# EAGLE design control_board-hall_test (EAGLE 8.3.1)
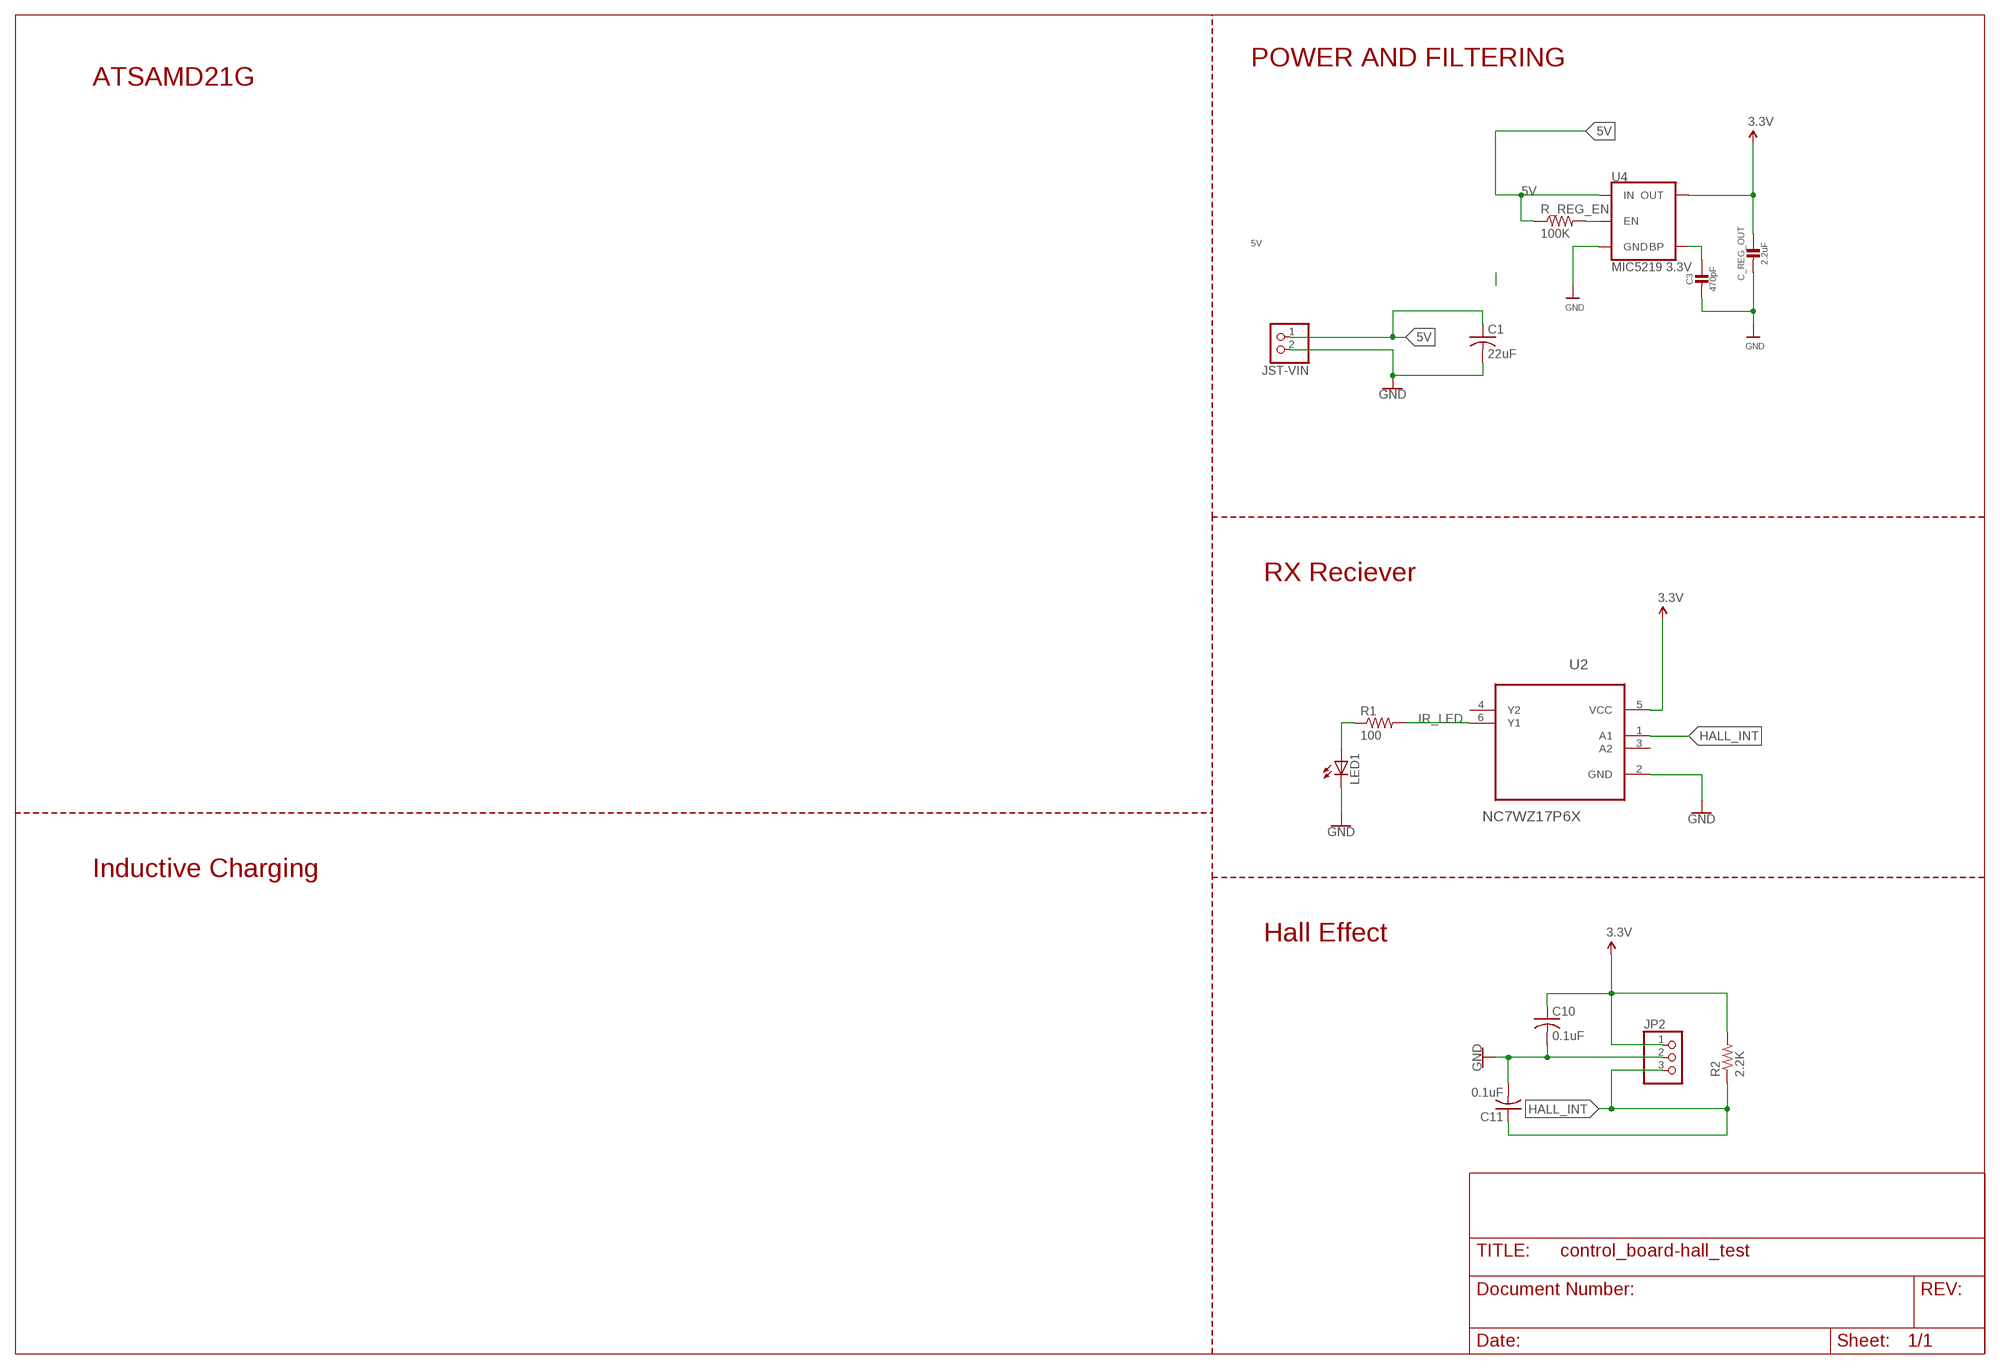
[diagram p0: schematic, sheet 1]

## Parts
C1  22uF  C-USC1206  [C1206]
C3  470pF  CAP_CERAMIC0603_NO  [0603-NO]
C10  0.1uF  C-USC0603  [C0603]
C11  0.1uF  C-USC0603  [C0603]
C_REG_OUT  2.2uF  CAP_CERAMIC0805-NOOUTLINE  [0805-NO]
JP2  PINHD-1X3  [1X03]
JST-VIN  JST_2PIN-THM-RA  [JST-PH-2-THM-RA]
LED1  LED3MM  [LED3MM]
R1  100  R-US_0207/9  [0207/9]
R2  2.2K  R-US_0207/9  [0207/9]
R_REG_EN  100K  R-US_R0603  [R0603]
U2  NC7WZ17P6X  [SOT65P210X110-6N]
U4  MIC5219 3.3V  V_REG_MIC52193.3V  [SOT23-5]

## Nets
3.3V: C10.1 C_REG_OUT.1 JP2.1 R2.2 U2.5(VCC) U4.5(OUT)
5V: C1.1 JST-VIN.1 R_REG_EN.1 U4.1(IN)
GND: C1.2 C3.2 C10.2 C11.2 C_REG_OUT.2 JP2.2 JST-VIN.2 LED1.K(C) U2.2(GND) U4.2(GND)
HALL_INT: C11.1 JP2.3 R2.1 U2.1(A1)
IR_LED: R1.2 U2.6(Y1)
N$1: LED1.A R1.1
N$5: R_REG_EN.2 U4.3(EN)
N$6: C3.1 U4.4(BP)
Unconnected: U2.3(A2) U2.4(Y2)

## Notes on the sheet
- ATSAMD21G | POWER AND FILTERING
- RX Reciever
- Inductive Charging
- Hall Effect

## Library data of the parts
C1 C10 C11 = adafruit:C-US: CAPACITOR, American symbol
C3 C_REG_OUT = microbuilder:CAP_CERAMIC: Ceramic Capacitors For new designs, use the packages preceded by an '_' character since they are more reliable: The following footprints should be used on most boards: _0402 - Standard footprint for regular board layouts _0603 - Standard footprint for regular board layouts _0805 - Standard footprint for regular board layouts _1206 - Standard footprint for regular board layouts For extremely tight-pitch boards where space is at a premium, the following 'micro-pitch' footprints can be used (smaller pads, no silkscreen outline, etc.): _0402MP - Micro-pitch footprint for very dense/compact boards _0603MP - Micro-pitch footprint for very dense/compact boards _0805MP - Micro-pitch footprint for very dense/compact boards _1206MP - Micro-pitch footprint for very dense/compact boards
JP2 = pinhead:PINHD-1X3: PIN HEADER
JST-VIN = adafruit:JST_2PIN: JST 2-Pin Connectors of various flavors SMT-RA (S2B-PH-SM4) 4UConnector #17311 SMT (B2B-PH-SM4) THM-RA (S2B-PH) THM (B2B-PH)
LED1 = adafruit:LED: LED OSRAM: - CHIPLED LG R971, LG N971, LY N971, LG Q971, LY Q971, LO R971, LY R971 LH N974, LH R974 LS Q976, LO Q976, LY Q976 LO Q996 - Hyper CHIPLED LW Q18S LB Q993, LB Q99A, LB R99A - SideLED LS A670, LO A670, LY A670, LG A670, LP A670 LB A673, LV A673, LT A673, LW A673 LH A674 LY A675 LS A676, LA A676, LO A676, LY A676, LW A676 LS A679, LY A679, LG A679 - Hyper Micro SIDELED® LS Y876, LA Y876, LO Y876, LY Y876 LT Y87S - SmartLED LW L88C, LW L88S LB L89C, LB L89S, LG L890 LS L89K, LO L89K, LY L89K LS L896, LA L896, LO L896, LY L896 - TOPLED LS T670, LO T670, LY T670, LG T670, LP T670 LSG T670, LSP T670, LSY T670, LOP T670, LYG T670 LG T671, LOG T671, LSG T671 LB T673, LV T673, LT T673, LW T673 LH T674 LS T676, LA T676, LO T676, LY T676, LB T676, LH T676, LSB T676, LW T676 LB T67C, LV T67C, LT T67C, LS T67K, LO T67K, LY T67K, LW E67C LS E67B, LA E67B, LO E67B, LY E67B, LB E67C, LV E67C, LT E67C LW T67C LS T679, LY T679, LG T679 LS T770, LO T770, LY T770, LG T770, LP T770 LB T773, LV T773, LT T773, LW T773 LH T774 LS E675, LA E675, LY E675, LS T675 LS T776, LA T776, LO T776, LY T776, LB T776 LHGB T686 LT T68C, LB T68C - Hyper Mini TOPLED® LB M676 - Mini TOPLED Santana® LG M470 LS M47K, LO M47K, LY M47K Source: http://www.osram.convergy.de/
R1 R2 R_REG_EN = adafruit:R-US_: RESISTOR, American symbol
U2 = NC7WZ17P6X:NC7WZ17P6X: Dual Buffer; AVAILABILITY: Good; DESCRIPTION: NC7WZ17 Series 5.5 V TinyLogic UHS Dual Buffer w/ Schmitt Trigger Inputs-SC-70-6; MF: Fairchild Semiconductor; MP: NC7WZ17P6X; PACKAGE: SC-70-6 Fairchild Semiconductor; PRICE: 0.10 USD
U4 = SparkFun-IC-Power:V_REG_MIC5219: V_REG MIC5219 Standard 3.3V and 5V 500mA LDO voltage regulator in SOT-23 layout. Micrel part MIC5219. BP (by-pass) pin is used to lower output noise with 470pF cap, may be left open.; PROD_ID: VREG-09872

## Board
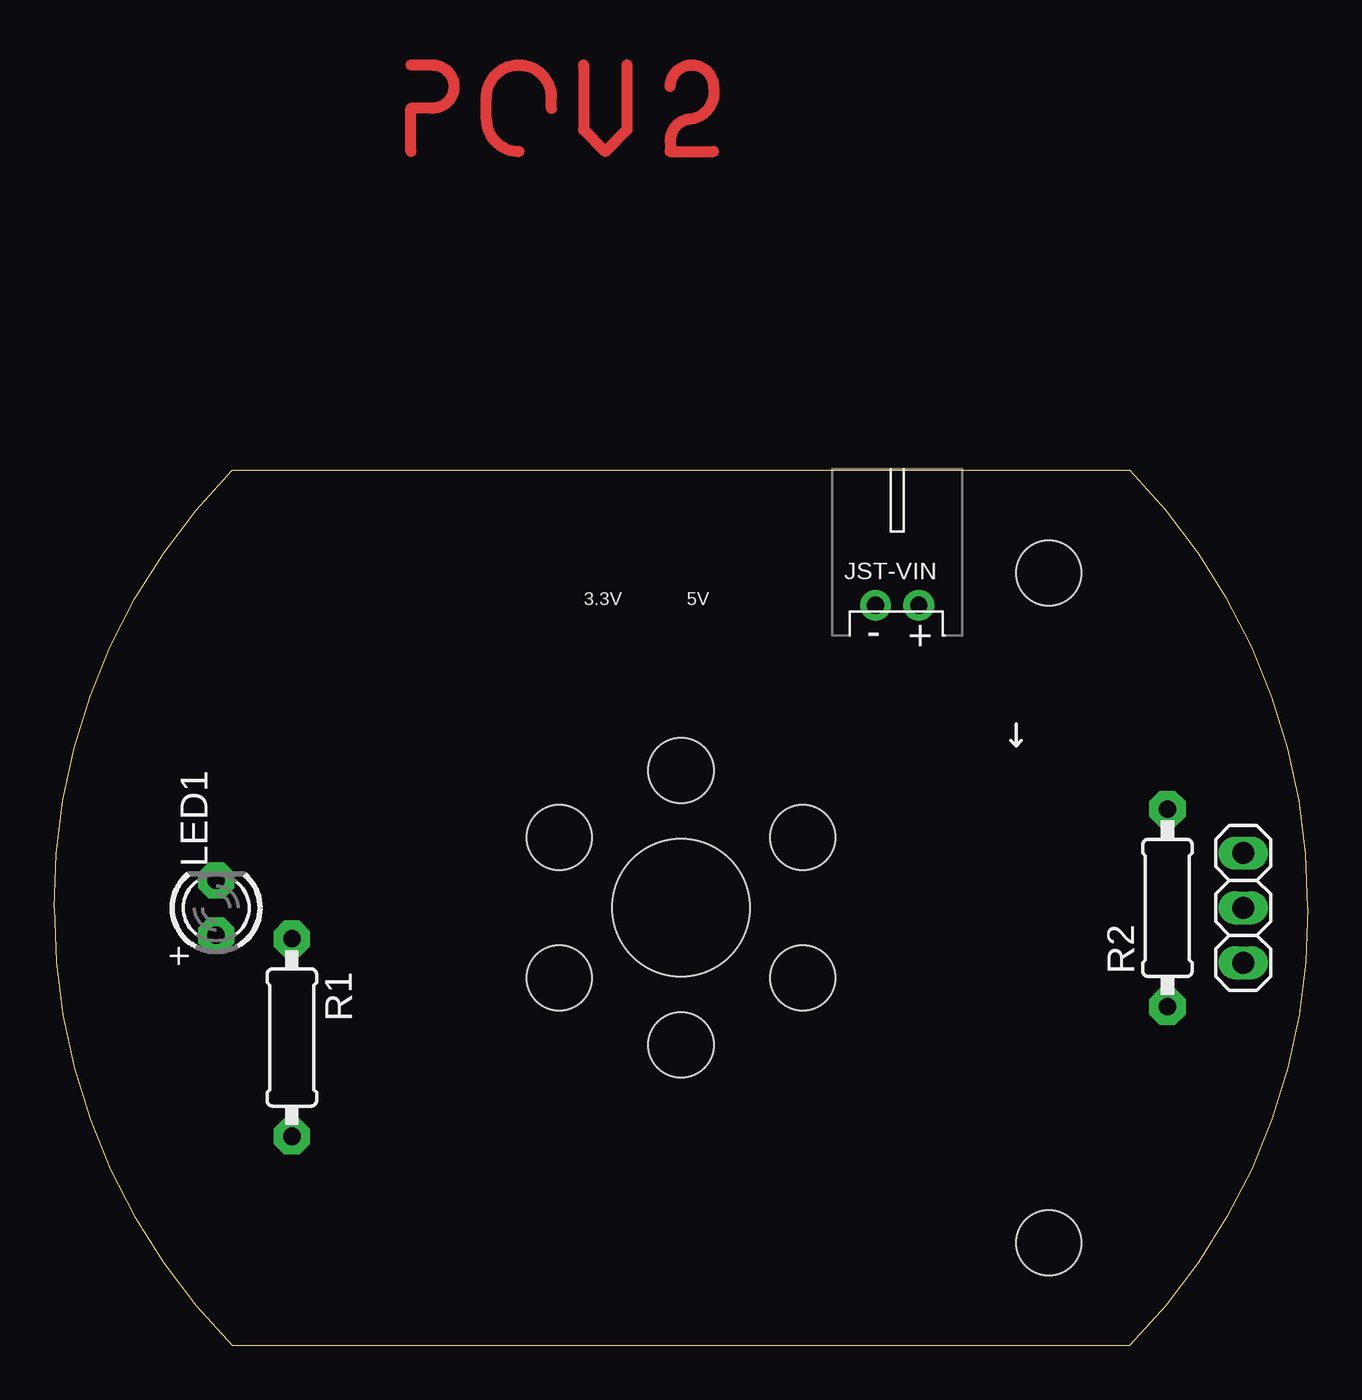
[diagram p1: board, top side]
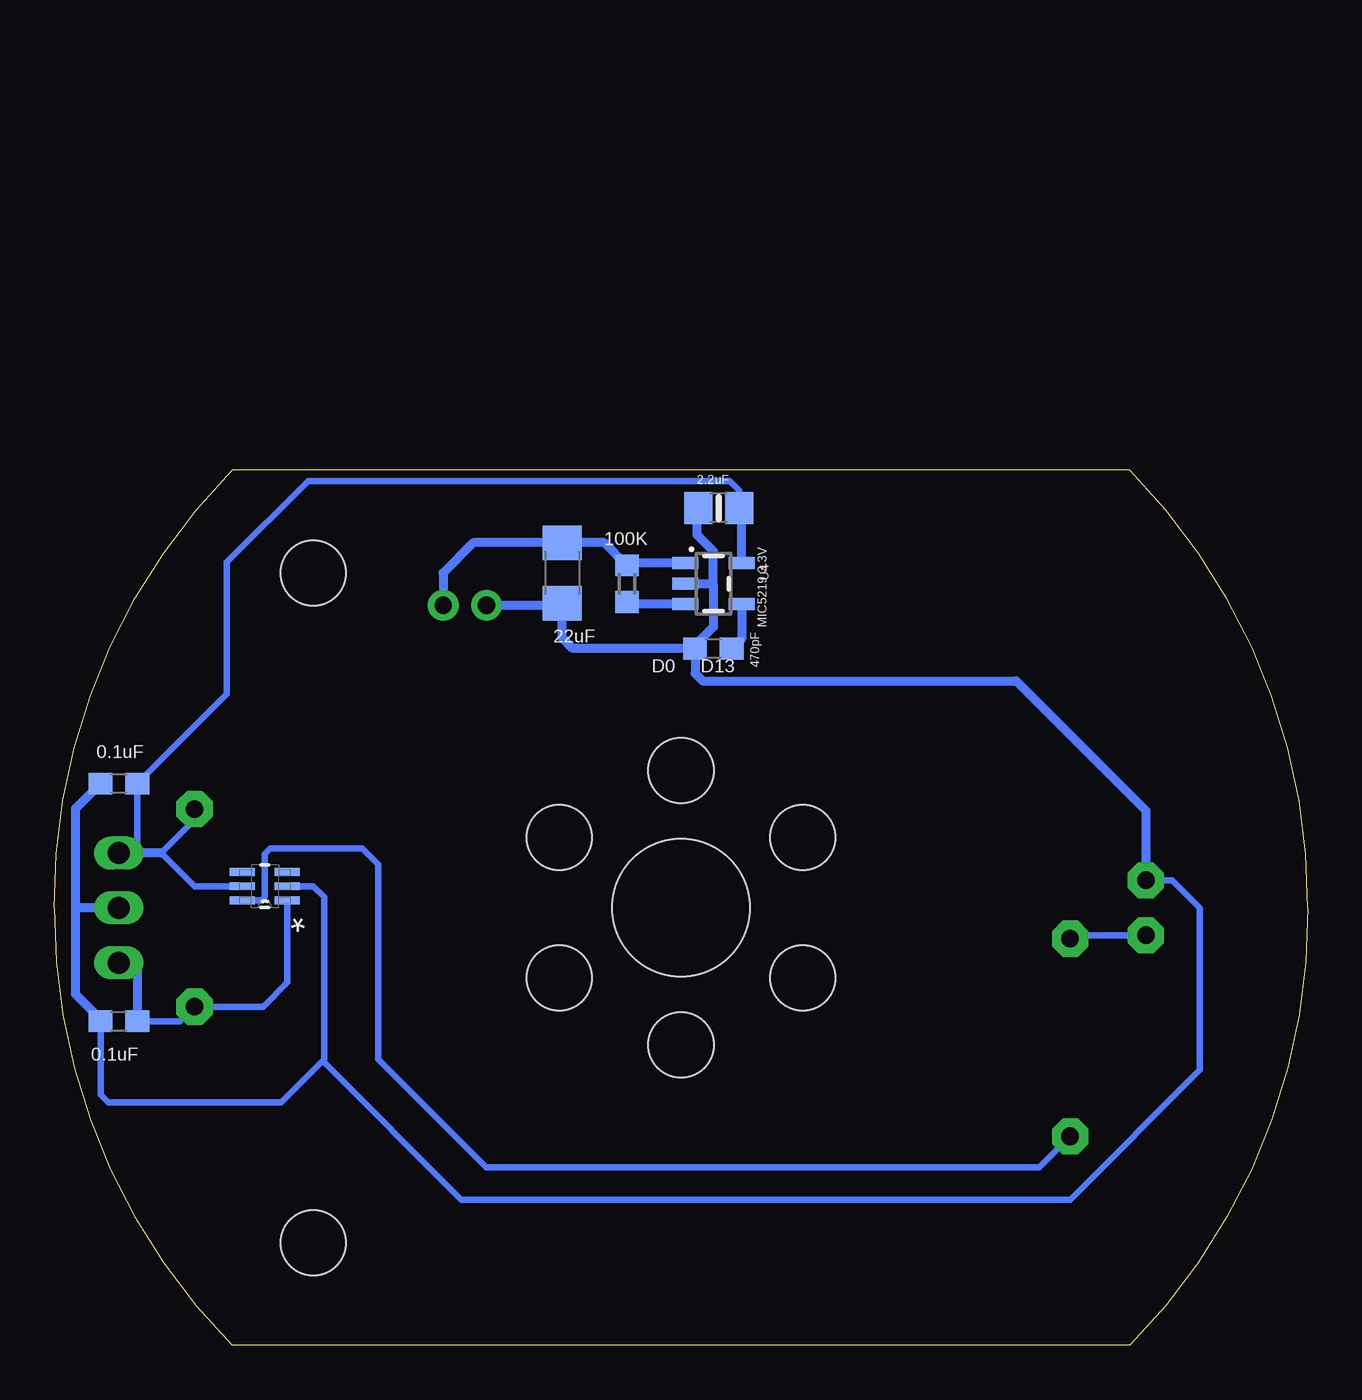
[diagram p2: board, bottom side, seen from below]

Size 58 x 40.5 mm. Coordinates in mm from the lower left corner, seen from the top.
Outline: 8.25,0 49.75,0 arc45 58,20.25 arc45 49.75,40.5 8.25,40.5 arc45 0,20.25 arc45 8.25,0
Copper layers (1*16): Top 0.035mm / dielectric 1.5mm / Bottom 0.035mm
Design rules "OthermillDRC_1_100_v2": minimum track width 8mil, minimum drill 0.8mm, track to track 0.256540625mm, track to pad 0.256540625mm, pad to pad 0.256540625mm, via to via 0.256540625mm, smd to smd 0mil, copper to edge 0mil, drill to drill 1mil, minimum pad ring 10mil, minimum via ring 10mil, stop-mask expansion 1mil, vias tented up to drill 30mil, thermal gap 10mil
Holes 6.35 mm at 29,20.25
Holes 3 mm at 29,26.6 34.63,17 23.37,17 46,35.75 46,4.75 29,13.9 23.37,23.5 34.63,23.5

### Footprints (pad centres in the part's own frame; a part is rotated, then mirrored left to right if it is on the bottom)
C1206 = smd 1.6 x 1.8: 1 -1.4,0; 2 1.4,0
0603-NO = smd 1.1 x 1: 1 -0.85,0; 2 0.85,0
C0603 = smd 1.1 x 1: 1 -0.85,0; 2 0.85,0
0805-NO = smd 1.3 x 1.5: 1 -0.95,0; 2 0.95,0
1X03 = drill 1.016 long: 1 -2.54,0; 2 0,0; 3 2.54,0
JST-PH-2-THM-RA = drill 0.8 pad 1.422: 1 1,0; 2 -1,0
LED3MM = drill 0.813 pad 1.676 octagon: A -1.27,0; K 1.27,0
0207/9 = drill 0.813 pad 1.676 octagon: 1 -4.572,0; 2 4.572,0
R0603 = smd 1 x 1.1: 1 -0.85,0; 2 0.85,0
SOT65P210X110-6N = smd 1.168 x 0.356: 1 -1.041,0.66; 2 -1.041,0; 3 -1.041,-0.66; 4 1.041,-0.66; 5 1.041,0; 6 1.041,0.66
SOT23-5 = smd 0.55 x 1.2: 1 -0.95,-1.3; 2 0,-1.3; 3 0.95,-1.3; 4 0.95,1.3; 5 -0.95,1.3

### Placement (x,y rotation side)
C1  34.5,35.75 270 bottom
C3  27.5,32.25 180 bottom
C10  55,26 180 bottom
C11  55,15 180 bottom
C_REG_OUT  27.25,38.75 180 bottom
JP2  55,20.25 270 top
JST-VIN  39,34.25 0 top
LED1  7.5,20.25 90 top
R1  11,14.25 270 top
R2  51.5,20.25 90 top
R_REG_EN  31.5,35.25 270 bottom
U2  48.25,21.25 180 bottom
U4  27.5,35.25 270 bottom

### Tracks (layer width: path | path; a pad name or v marks a point on that pad's centre or on a via)
2
  Top 0.508: 28.5,58.25 arc-90 29.5,59.25 arc-90 30.5,58.25 arc-90 29.5,56.75 arc90 28.5,55.75 28.5,55.25 30.5,55.25
3.3V
  Bottom 0.305: C_REG_OUT.1 26.3,39.55 26.75,40 46.25,40 50,36.25 50,30.15 C10.1 54.15,22.79 | U2.5 51.5,21.25 53.04,22.79 51.5,24.33 R2.2
  Bottom 0.406: 53.04,22.79 54.15,22.79 JP2.1 | U4.5 26.2,38.65 C_REG_OUT.1
5V
  Bottom 0.406: U4.1 31.4,36.2 R_REG_EN.1 32.55,37.15 C1.1 38.6,37.15 40,35.75 JST-VIN.1
GND
  Bottom 0.305: U2.2 46,21.25 45.5,20.75 45.5,13.25 45.58,13.17 | 45.58,13.17 47.5,11.25 55.5,11.25 55.85,11.6 C11.2 | LED1.K 6.27,21.52 5,20.25 5,12.75 11,6.75 39.16,6.75 45.58,13.17
  Bottom 0.406: 56,20.25 JP2.2 56.84,20.25 57,20.41 | 34.6,34.25 JST-VIN.2 | 34.6,34.25 C1.2 | C3.2 28.35,32.4 27.5,33.25 27.5,35.17 | 27.5,35.17 27.5,36.75 28.25,37.5 28.25,38.7 C_REG_OUT.2 | U4.2 27.58,35.25 27.5,35.17 | C3.2 28.35,31.1 28,30.75 13.5,30.75 7.5,24.75 LED1.K | 57,20.41 57,16.25 55.85,15.1 C11.2 | 57,20.41 57,24.25 57,24.5 57,24.85 C10.2 | C3.2 34,32.25 34.5,32.75 34.5,34.15 34.6,34.25
HALL_INT
  Bottom 0.305: U2.1 47.21,16.79 48.32,15.68 R2.1 52.18,15 C11.1
  Bottom 0.406: JP2.3 54.16,17.71 54.15,17.7 C11.1
IR_LED
  Bottom 0.305: U2.6 48.37,20.59 48.3,20.66 48.3,20.7 48.25,20.75 48.25,22.75 48,23 43.75,23 43,22.25 43,13.25 38,8.25 12.43,8.25 R1.2
N$1
  Bottom 0.305: LED1.A 10.84,18.98 R1.1
N$5
  Bottom 0.406: U4.3 31.4,34.3 R_REG_EN.2
N$6
  Bottom 0.406: U4.4 26.2,32.7 C3.1
O
  Top 0.508: 23,57.25 23,57.75 arc90 21.5,59.25 arc90 20,57.75 20,56.75 arc90 21.5,55.25
P
  Top 0.508: 16.5,55.25 16.5,57.25 17.5,57.25 arc90 18.5,58.25 arc90 17.5,59.25 16.5,59.25
V
  Top 0.508: 24.5,59.25 24.5,56.25 25.5,55.25 26.5,56.25 26.5,59.25

### Text on the board
tPlace: 3.3V | 5V
bPlace: D13 | D0